# EAGLE design AT42QT2120-breakout-v0 (EAGLE 9.3.0)
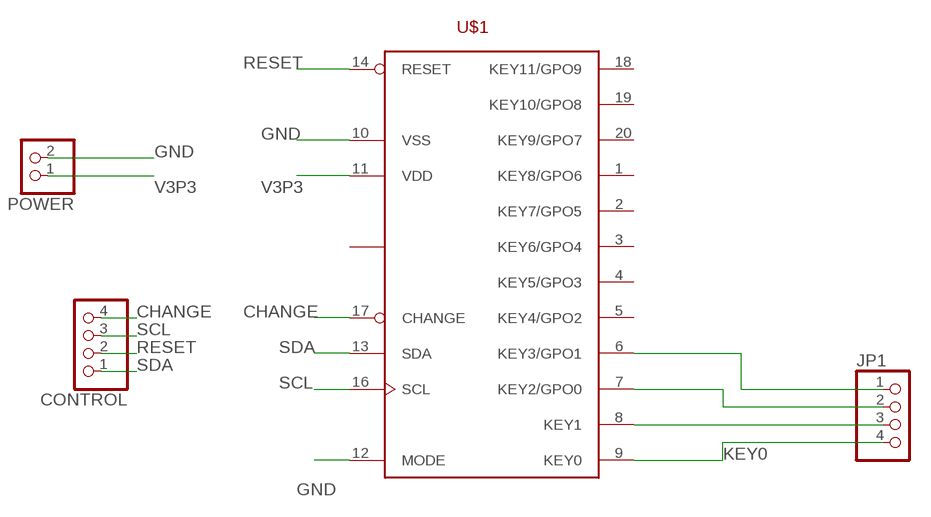
[diagram p0: schematic, sheet 1]

## Parts
CONTROL  PINHD-1X4/90  [1X04/90]
JP1  PINHD-1X4/90  [1X04/90]
POWER  PINHD-1X2/90  [1X02/90]
U$1  COMMS-AT42QT2120SU  [SO20W]

## Nets
CHANGE: CONTROL.4 U$1.17(CHANGE)
GND: POWER.2 U$1.10(VSS) U$1.12(MODE)
KEY0: JP1.4 U$1.9(KEY0)
N$3: JP1.1 U$1.6(KEY3/GPO1)
N$6: JP1.3 U$1.8(KEY1)
N$7: JP1.2 U$1.7(KEY2/GPO0)
RESET: CONTROL.2 U$1.14(RESET)
SCL: CONTROL.3 U$1.16(SCL)
SDA: CONTROL.1 U$1.13(SDA)
V3P3: POWER.1 U$1.11(VDD)
Unconnected: U$1.1(KEY8/GPO6) U$1.2(KEY7/GPO5) U$1.3(KEY6/GPO4) U$1.4(KEY5/GPO3) U$1.5(KEY4/GPO2) U$1.15(NC) U$1.18(KEY11/GPO9) U$1.19(KEY10/GPO8) U$1.20(KEY9/GPO7)

## Library data of the parts
CONTROL JP1 = pinhead:PINHD-1X4: PIN HEADER
POWER = pinhead:PINHD-1X2: PIN HEADER
U$1 = AT42QT2120:COMMS-AT42QT2120

## Board
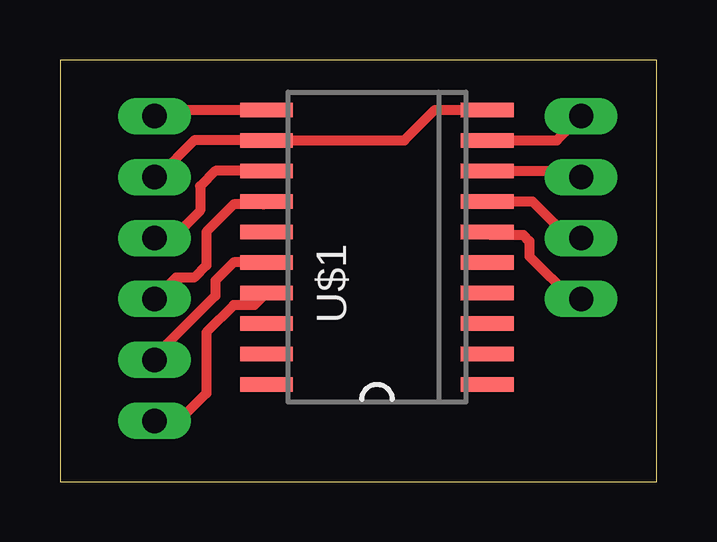
[diagram p1: board, top side]
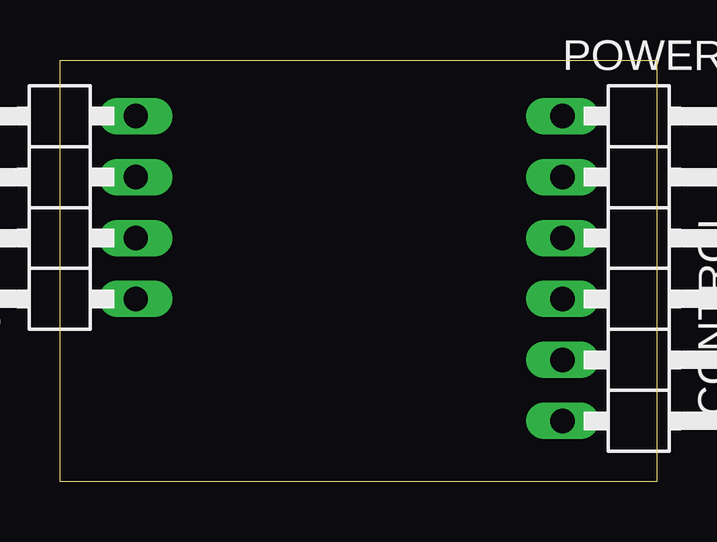
[diagram p2: board, bottom side, seen from below]

Size 24.87 x 17.58 mm. Coordinates in mm from the lower left corner, seen from the top.
Outline: 0,0 24.87,0 24.87,17.58 0,17.58 0,0
Copper layers (1*16): Top 0.035mm / dielectric 1.5mm / Bottom 0.035mm
Design rules "default": minimum track width 6mil, minimum drill 0.35mm, track to track 6mil, track to pad 6mil, pad to pad 6mil, via to via 6mil, smd to smd 6mil, copper to edge 40mil, drill to drill 6mil, minimum pad ring 10mil, minimum via ring 8mil, stop-mask expansion 4mil, vias tented up to drill 0mil, thermal gap 10mil

### Footprints (pad centres in the part's own frame; a part is rotated, then mirrored left to right if it is on the bottom)
1X04/90 = drill 1.016 long: 1 -3.81,-3.81; 2 -1.27,-3.81; 3 1.27,-3.81; 4 3.81,-3.81
1X02/90 = drill 1.016 long: 1 -1.27,-3.81; 2 1.27,-3.81
SO20W = smd 0.6 x 2.2: 1 -5.715,-4.6; 2 -4.445,-4.6; 3 -3.175,-4.6; 4 -1.905,-4.6; 5 -0.635,-4.6; 6 0.635,-4.6; 7 1.905,-4.6; 8 3.175,-4.6; 9 4.445,-4.6; 10 5.715,-4.6; 11 5.715,4.6; 12 4.445,4.6; 13 3.175,4.6; 14 1.905,4.6; 15 0.635,4.6; 16 -0.635,4.6; 17 -1.905,4.6; 18 -3.175,4.6; 19 -4.445,4.6; 20 -5.715,4.6

### Placement (x,y rotation side)
CONTROL  0.13,6.35 270 bottom
JP1  25.53,11.43 90 bottom
POWER  0.13,13.97 270 bottom
U$1  13.21,9.78 90 top

### Tracks (layer width: path | path; a pad name or v marks a point on that pad's centre or on a via)
CHANGE
  Top 0.406: U$1.17 8.1,7.37 7.24,7.37 6.1,6.22 6.1,3.68 4.95,2.54 CONTROL.4
GND
  Top 0.406: U$1.10 15.62,15.49 14.35,14.22 U$1.12 5.59,14.22 4.06,12.7 POWER.2
KEY0
  Top 0.406: U$1.9 20.7,14.22 JP1.4
N$3
  Top 0.406: U$1.6 17.93,10.29 19.3,10.29 19.56,10.03 19.56,9.4 21.34,7.62 JP1.1
N$6
  Top 0.406: U$1.8 21.46,12.95 JP1.3
N$7
  Top 0.406: U$1.7 19.68,11.68 21.21,10.16 JP1.2
RESET
  Top 0.406: U$1.14 8.48,11.56 7.24,11.56 6.1,10.41 6.1,9.02 5.59,8.51 4.83,8.51 CONTROL.2
SCL
  Top 0.406: U$1.16 7.24,9.14 6.48,8.38 6.48,7.75 3.94,5.21 CONTROL.3
SDA
  Top 0.406: 7.62,12.95 U$1.13 6.48,12.95 5.84,12.32 5.84,11.3 4.7,10.16 CONTROL.1
V3P3
  Top 0.406: POWER.1 4.19,15.49 U$1.11